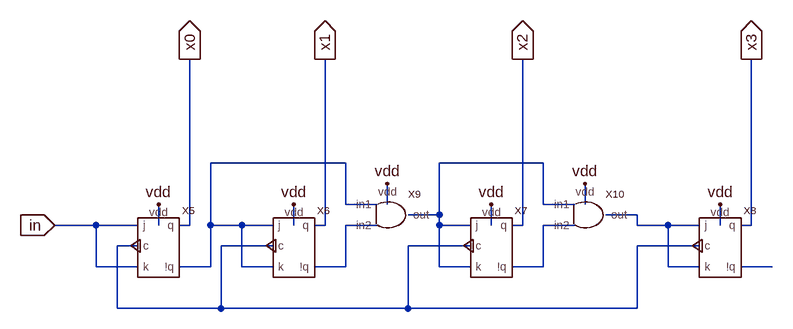
[diagram p0: schematic DecCounter.asc]
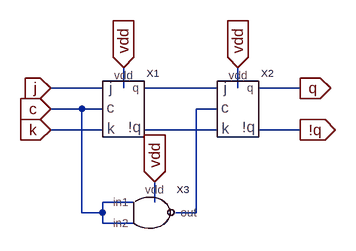
[diagram p1: sub-circuit jk-front-trigger.asc]
DecCounter.asc, the LTspice schematic file:
Version 4
SHEET 1 1748 740
WIRE -2848 480 -3056 480
WIRE -2544 480 -2704 480
WIRE -2848 544 -2848 480
WIRE -2800 544 -2848 544
WIRE -2784 544 -2784 512
WIRE -2544 544 -2544 480
WIRE -2496 544 -2544 544
WIRE -2480 544 -2480 512
WIRE -2704 560 -2704 480
WIRE -2704 560 -2752 560
WIRE -2400 560 -2448 560
WIRE -3232 576 -3296 576
WIRE -3168 576 -3232 576
WIRE -3136 576 -3136 544
WIRE -3088 576 -3088 320
WIRE -3088 576 -3104 576
WIRE -3056 576 -3056 480
WIRE -3008 576 -3056 576
WIRE -2960 576 -3008 576
WIRE -2928 576 -2928 544
WIRE -2880 576 -2880 320
WIRE -2880 576 -2896 576
WIRE -2800 576 -2848 576
WIRE -2704 576 -2704 560
WIRE -2656 576 -2704 576
WIRE -2624 576 -2624 544
WIRE -2576 576 -2576 320
WIRE -2576 576 -2592 576
WIRE -2496 576 -2544 576
WIRE -2400 576 -2400 560
WIRE -2352 576 -2400 576
WIRE -2304 576 -2352 576
WIRE -2272 576 -2272 544
WIRE -2224 576 -2224 320
WIRE -2224 576 -2240 576
WIRE -3168 608 -3200 608
WIRE -2960 608 -3040 608
WIRE -2656 608 -2752 608
WIRE -2304 608 -2400 608
WIRE -3232 640 -3232 576
WIRE -3168 640 -3232 640
WIRE -3056 640 -3056 576
WIRE -3056 640 -3104 640
WIRE -3008 640 -3008 576
WIRE -2960 640 -3008 640
WIRE -2848 640 -2848 576
WIRE -2848 640 -2896 640
WIRE -2704 640 -2704 576
WIRE -2656 640 -2704 640
WIRE -2544 640 -2544 576
WIRE -2544 640 -2592 640
WIRE -2352 640 -2352 576
WIRE -2304 640 -2352 640
WIRE -2192 640 -2240 640
WIRE -3200 704 -3200 608
WIRE -3040 704 -3040 608
WIRE -3040 704 -3200 704
WIRE -2752 704 -2752 608
WIRE -2752 704 -3040 704
WIRE -2400 704 -2400 608
WIRE -2400 704 -2752 704
FLAG -3088 320 x0
IOPIN -3088 320 Out
FLAG -2880 320 x1
IOPIN -2880 320 Out
FLAG -2576 320 x2
IOPIN -2576 320 Out
FLAG -2224 320 x3
IOPIN -2224 320 Out
FLAG -2272 544 vdd
FLAG -2928 544 vdd
FLAG -3136 544 vdd
FLAG -2624 544 vdd
FLAG -2784 512 vdd
FLAG -2480 512 vdd
FLAG -3296 576 in
IOPIN -3296 576 In
SYMBOL jk-front-trigger -3136 608 R0
SYMATTR InstName X5
SYMBOL jk-front-trigger -2928 608 R0
SYMATTR InstName X6
SYMBOL jk-front-trigger -2624 608 R0
SYMATTR InstName X7
SYMBOL jk-front-trigger -2272 608 R0
SYMATTR InstName X8
SYMBOL and -2784 560 R0
SYMATTR InstName X9
SYMBOL and -2480 560 R0
SYMATTR InstName X10

jk-front-trigger.asc, the sub-circuit schematic file:
Version 4
SHEET 1 880 680
WIRE 48 128 -32 128
WIRE 80 128 80 96
WIRE 224 128 112 128
WIRE 256 128 256 96
WIRE 352 128 288 128
WIRE 16 160 -32 160
WIRE 48 160 16 160
WIRE 224 160 192 160
WIRE 48 192 -32 192
WIRE 224 192 112 192
WIRE 352 192 288 192
WIRE 96 304 48 304
WIRE 128 304 128 272
WIRE 16 320 16 160
WIRE 48 320 48 304
WIRE 48 320 16 320
WIRE 192 320 192 160
WIRE 192 320 160 320
WIRE 48 336 48 320
WIRE 96 336 48 336
FLAG 256 96 vdd
IOPIN 256 96 In
FLAG 80 96 vdd
IOPIN 80 96 In
FLAG 352 128 q
IOPIN 352 128 Out
FLAG 352 192 !q
IOPIN 352 192 Out
FLAG -32 128 j
IOPIN -32 128 In
FLAG -32 192 k
IOPIN -32 192 In
FLAG -32 160 c
IOPIN -32 160 In
FLAG 128 272 vdd
IOPIN 128 272 In
SYMBOL jk-trigger 80 160 R0
SYMATTR InstName X1
SYMBOL jk-trigger 256 160 R0
SYMATTR InstName X2
SYMBOL nand 112 320 R0
SYMATTR InstName X3

The netlist it stands for:
* DecCounter.asc
XX5 in N006 in x0 N001 vdd jk-front-trigger
XX6 N001 N006 N001 x1 N004 vdd jk-front-trigger
XX7 N002 N006 N002 x2 N005 vdd jk-front-trigger
XX8 N003 N006 N003 x3 N007 vdd jk-front-trigger
XX9 N001 N004 vdd N002 and  ; pins in1 in2 vdd out
XX10 N002 N005 vdd N003 and  ; pins in1 in2 vdd out

* block symbol definitions
.subckt jk-front-trigger j c k q !q vdd
XX1 k c j vdd N003 N001 jk-trigger  ; pins k c j vdd !q q
XX2 N003 N002 N001 vdd !q q jk-trigger  ; pins k c j vdd !q q
XX3 c c N002 vdd nand  ; pins in1 in2 out vdd
.ends jk-front-trigger

.backanno
.end